# Altium schematic sheet Buck_converter.SchDoc
size A4; SheetNumber: 11; SheetTotal: 14
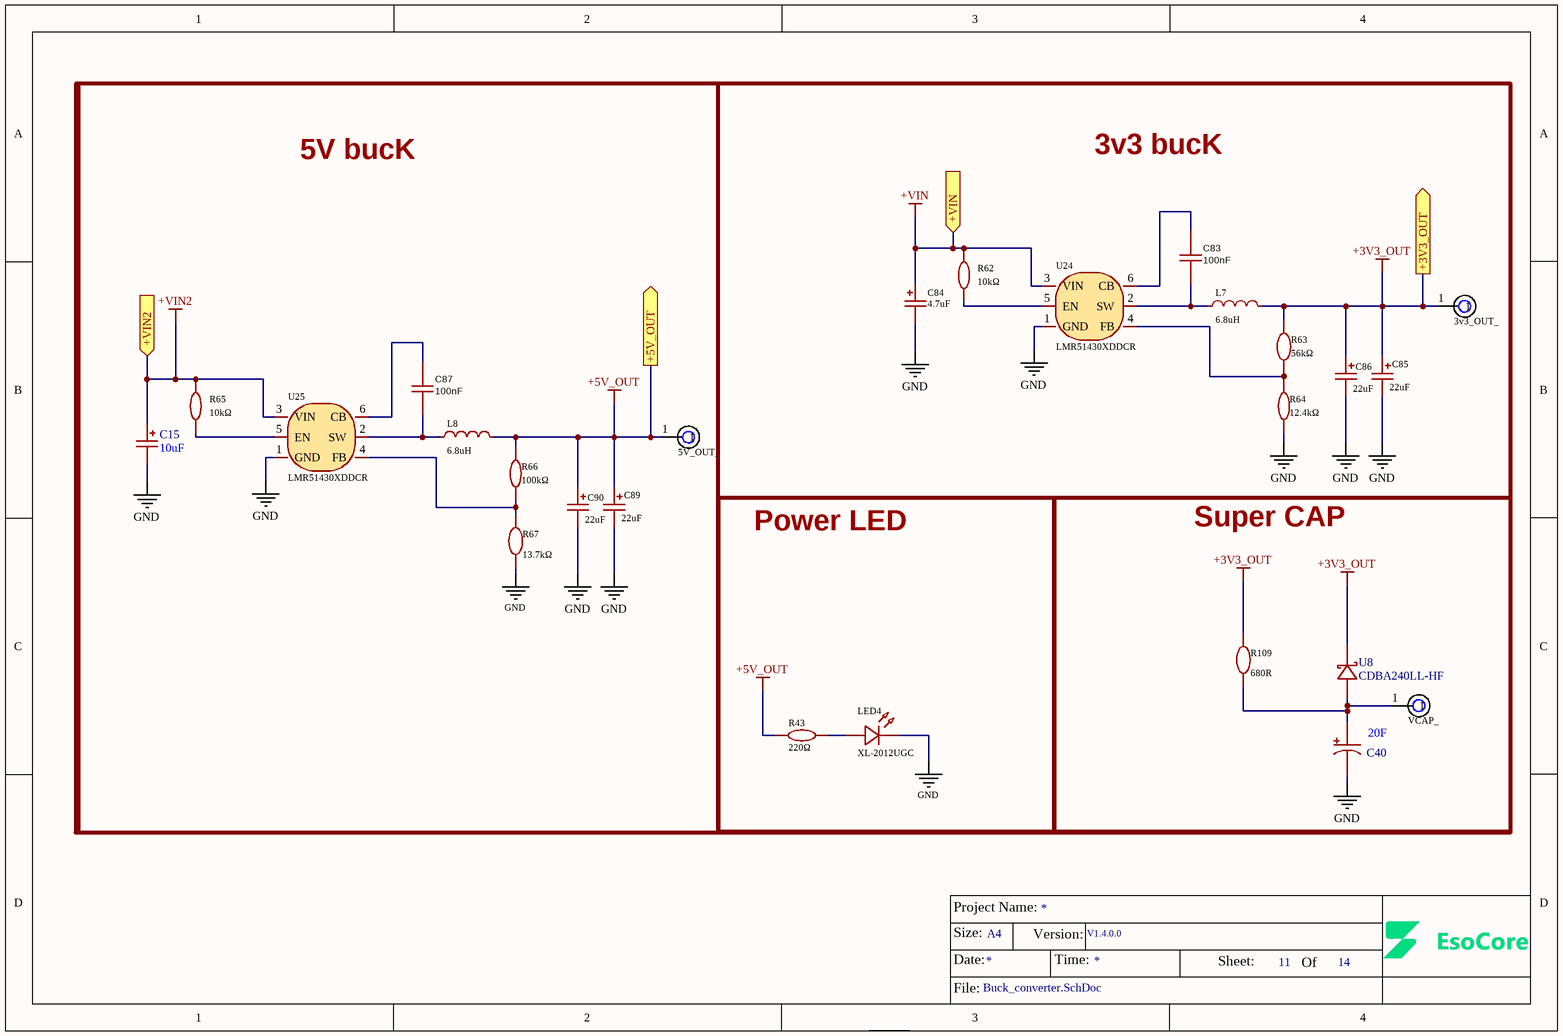
[diagram p0: Buck_converter.SchDoc]

## Parts
3v3_OUT_  TP  [TP]  (value not drawn)  (no BOM)
5V_OUT_  TP  [TP]  (value not drawn)  (no BOM)
C15  10uF  [CASE-C_6032]
C40  20F  [CAP-TH_BD8.0-P3.50-D0.6-FD]
C83  100nF  [C_0805]
C84  4.7uF  [CAP-SMD_L6.0-W3.2-R-RD]
C85  22uF  [CASE-A_3216]
C86  22uF  [CASE-A_3216]
C87  100nF  [C_0805]
C89  22uF  [CASE-A_3216]
C90  22uF  [CASE-A_3216]
L7  6.8uH  [IND-SMD_L5.4-W5.2_SLO0530H6R8MTT]
L8  6.8uH  [IND-SMD_L5.4-W5.2_SLO0530H6R8MTT]
LED4  XL-2012UGC  [LED0805-RD_GREEN]
R43  220Ω  [R_0603]
R62  10kΩ  [R_0603]
R63  56kΩ  [R_0805]
R64  12.4kΩ  [R_0805]
R65  10kΩ  [R_0603]
R66  100kΩ  [R_0805]
R67  13.7kΩ  [R_0805]
R109  680R  [R_0805]
U8  CDBA240LL-HF  [SMA_L4.4-W2.5-LS5.2-R-RD]
U24  LMR51430XDDCR  [SOT-23-6_L2.9-W1.6-P0.95-LS2.8-BR]
U25  LMR51430XDDCR  [SOT-23-6_L2.9-W1.6-P0.95-LS2.8-BR]
VCAP_  TP  [TP]  (value not drawn)  (no BOM)

## Blocks framed on the sheet
3v3 bucK: 3v3_OUT_ C83-C86 L7 R62-R64 U24
5V bucK: 5V_OUT_ C15 C87 C89 C90 L8 R65-R67 U25
Power LED: LED4 R43
Super CAP: C40 R109 U8 VCAP_

## Ports
+3V3_OUT (out), +5V_OUT (out), +VIN2 (in), +VIN (in)

## Nets
+3V3_OUT: 3v3_OUT_.1 C85.1 C86.1 L7.2 R63.2 R109.2 U8.2(K) ; port +3V3_OUT
+5V_OUT: 5V_OUT_.1 C89.1 C90.1 L8.2 R43.2 R66.2 ; port +5V_OUT
+VIN: C84.1 R62.2 U24.3(VIN) ; port +VIN
+VIN2: C15.1 R65.2 U25.3(VIN) ; port +VIN2
GND: C15.2 C40.2 C84.2 C85.2 C86.2 C89.2 C90.2 LED4.1(K) R64.1 R67.1 U24.1(GND) U25.1(GND)
NetC40_1: C40.1 R109.1 U8.1(A) VCAP_.1
NetC83_1: C83.1 L7.1 U24.2(SW)
NetC83_2: C83.2 U24.6(CB)
NetC87_1: C87.1 L8.1 U25.2(SW)
NetC87_2: C87.2 U25.6(CB)
NetLED4_2: LED4.2(A) R43.1
NetR62_1: R62.1 U24.5(EN)
NetR63_1: R63.1 R64.2 U24.4(FB)
NetR65_1: R65.1 U25.5(EN)
NetR66_1: R66.1 R67.2 U25.4(FB)

## Notes on the sheet
- Project Name:
- Size:
- Date:
- A4
- Version:
- Time:
- V1.4.0.0
- Sheet:
- Of
- File:

## Library data of the parts
C15 = TAJC106K035RNJ: Manufacturer: Kyocera AVX; Add into BOM: yes; Tolerance: ±10%; Voltage Rating: 35V; Equivalent Series Resistance(ESR): 1.6Ω@100kHz; Symbol: TAJC106K035RNJ; Device: TAJC106K035RNJ; LCSC Part Name: 10uF ±10% 35V; Supplier Part: C7211; Manufacturer Part: TAJC106K035RNJ; Supplier Footprint: CASE-C-6032-28(mm); JLCPCB Part Class: Extended Part; Supplier: LCSC; Convert to PCB: yes; Value: 10uF; Operating Temperature: -55℃~+125℃
C40 = SLA3R8L2060813: Manufacturer: Ymin(永铭); Add into BOM: yes; Tolerance: -10%~+30%; Voltage Rating: 3.8V; Equivalent Series Resistance(ESR): 500mΩ; Lifetime: 1000hrs@85℃; Symbol: SLA3R8L2060813; Device: SLA3R8L2060813; LCSC Part Name: 20F -10%~+30% 3.8V; Supplier Part: C970391; Manufacturer Part: SLA3R8L2060813; Supplier Footprint: 插件,P=3.5mm; JLCPCB Part Class: Extended Part; Datasheet: https://item.szlcsc.com/datasheet/SLA3R8L2060813/1059775.html; Supplier: LCSC; Convert to PCB: yes; Value: 20F; Current - Leakage: -; Operating Temperature: -40℃~+85℃; Diameter: 8mm; Height - Seated(Max): -
C83 C87 = 100nF: Manufacturer Part: CC0805KRX7R9BB104; Manufacturer: YAGEO(国巨); nameAlias: Value; Supplier: LCSC; Supplier Part: C49678; JLCPCB Part Class: Basic Part; spicePre: C; spiceSymbolName: CC0805KRX7R9BB104
C84 = TAJC475K035RNJ: Manufacturer: Kyocera AVX; Add into BOM: yes; Tolerance: ±10%; Voltage Rating: 35V; Equivalent Series Resistance(ESR): 2.2Ω@100kHz; Symbol: TAJC475K035RNJ; Device: TAJC475K035RNJ; LCSC Part Name: 4.7uF ±10% 35V; Supplier Part: C11378; Manufacturer Part: TAJC475K035RNJ; Supplier Footprint: CASE-C-6032-28(mm); JLCPCB Part Class: Extended Part; Supplier: LCSC; Convert to PCB: yes; Value: 4.7uF; Operating Temperature: -55℃~+125℃
C85 C86 C89 C90 = TAJA226K010RNJ: Manufacturer: Kyocera AVX; Add into BOM: yes; Tolerance: ±10%; Voltage Rating: 10V; Equivalent Series Resistance(ESR): 3Ω@100kHz; Symbol: TAJA226K010RNJ; Device: TAJA226K010RNJ; LCSC Part Name: 22uF ±10% 10V; Supplier Part: C11366; Manufacturer Part: TAJA226K010RNJ; Supplier Footprint: CASE-A-3216-18(mm); JLCPCB Part Class: Extended Part; Supplier: LCSC; Convert to PCB: yes; Value: 22uF; Operating Temperature: -55℃~+125℃
L7 L8 = SLO0530H6R8MTT: Manufacturer: Sunltech(顺磁); Add into BOM: yes; Tolerance: ±20%; Current Rating: 4A; DC Resistance(DCR): 66mΩ; Symbol: SLO0530H6R8MTT; Device: SLO0530H6R8MTT; LCSC Part Name: 6.8uH ±20%; Supplier Part: C325965; Manufacturer Part: SLO0530H6R8MTT; Supplier Footprint: SMD; JLCPCB Part Class: Extended Part; Datasheet: https://item.szlcsc.com/datasheet/SLO0530H6R8MTT/306182.html; Supplier: LCSC; Convert to PCB: yes; Value: 6.8uH
LED4 = XL-2012UGC: Manufacturer: XINGLIGHT(成兴光); Add into BOM: yes; Illumination Color: Emerald; Voltage - Forward(Vf): 3.2V; Power(Watts): 70mW; Forward Current: 20mA; Wavelength - Dominant: 515nm~535nm; Peak Wavelength: 525nm; Lens Color: Colorless Transparent Lens; Luminous Intensity: 750mcd; Viewing Angle: 120°; Mounting Sytle: Positive Stick; Symbol: XL-2012UGC; Device: XL-2012UGC; LCSC Part Name: XL-2012UGC; Supplier Part: C965815; Manufacturer Part: XL-2012UGC; Supplier Footprint: 0805; JLCPCB Part Class: Extended Part; Datasheet: https://item.szlcsc.com/datasheet/XL-2012UGC/1051424.html; Supplier: LCSC; Convert to PCB: yes; Color Temperature: -; Operating Temperature: -20℃~+85℃
R43 = RC0603FR-07220RL: Manufacturer: YAGEO(国巨); Add into BOM: yes; Tolerance: ±1%; Temperature Coefficient: ±100ppm/℃; Symbol: RC0603FR-07220RL; Device: RC0603FR-07220RL; LCSC Part Name: 厚膜电阻 220Ω ±1% 100mW; Supplier Part: C107696; Manufacturer Part: RC0603FR-07220RL; Supplier Footprint: 0603; JLCPCB Part Class: Extended Part; Datasheet: https://atta.szlcsc.com/upload/public/pdf/source/20180821/C275644_0D56F95EFF785E7D9A1FEF436B37DA78.pdf; Supplier: LCSC; Convert to PCB: yes; Type: Thick Film Resistors; Value: 220Ω; Operating Temperature Range: -55℃~+155℃
R62 R65 = RC0603FR-0710KL: Manufacturer: YAGEO(国巨); Add into BOM: yes; Tolerance: ±1%; Temperature Coefficient: ±100ppm/℃; Symbol: RC0603FR-0710KL; Device: RC0603FR-0710KL; LCSC Part Name: 厚膜电阻 10kΩ ±1% 100mW; Supplier Part: C98220; Manufacturer Part: RC0603FR-0710KL; Supplier Footprint: 0603; JLCPCB Part Class: Extended Part; Datasheet: https://atta.szlcsc.com/upload/public/pdf/source/20180927/C295883_E8D83085EA81BD7DE0B2B681138C15EE.pdf; Supplier: LCSC; Convert to PCB: yes; Type: Thick Film Resistors; Value: 10kΩ; Operating Temperature Range: -55℃~+155℃
R63 = RT0805BRC0756KL: Manufacturer: YAGEO(国巨); Add into BOM: yes; Tolerance: ±0.1%; Temperature Coefficient: ±15ppm/℃; Symbol: RT0805BRC0756KL; Device: RT0805BRC0756KL; LCSC Part Name: 薄膜电阻 56kΩ ±0.1% 125mW; Supplier Part: C706209; Manufacturer Part: RT0805BRC0756KL; Supplier Footprint: 0805; JLCPCB Part Class: Extended Part; Datasheet: https://atta.szlcsc.com/upload/public/pdf/source/20200720/C706209_4397051C8D9630730FE7B6DC464F826A.pdf; Supplier: LCSC; Convert to PCB: yes; Type: Thin Film Resistor; Value: 56kΩ; Operating Temperature Range: -55℃~+155℃
R64 = RC0805FR-0712K4L: Manufacturer: YAGEO(国巨); Add into BOM: yes; Tolerance: ±1%; Temperature Coefficient: ±100ppm/℃; Symbol: RC0805FR-0712K4L; Device: RC0805FR-0712K4L; LCSC Part Name: 厚膜电阻 12.4kΩ ±1% 125mW; Supplier Part: C137595; Manufacturer Part: RC0805FR-0712K4L; Supplier Footprint: 0805; JLCPCB Part Class: Extended Part; Datasheet: https://atta.szlcsc.com/upload/public/pdf/source/20180821/C275644_0D56F95EFF785E7D9A1FEF436B37DA78.pdf; Supplier: LCSC; Convert to PCB: yes; Type: Thick Film Resistors; Value: 12.4kΩ; Operating Temperature Range: -55℃~+155℃
R66 = RC0805FR-07100KL: Manufacturer: YAGEO(国巨); Add into BOM: yes; Tolerance: ±1%; Temperature Coefficient: ±100ppm/℃; Symbol: RC0805FR-07100KL; Device: RC0805FR-07100KL; LCSC Part Name: 厚膜电阻 100kΩ ±1% 125mW; Supplier Part: C96346; Manufacturer Part: RC0805FR-07100KL; Supplier Footprint: 0805; JLCPCB Part Class: Extended Part; Datasheet: https://atta.szlcsc.com/upload/public/pdf/source/20170708/1499509500945.pdf; Supplier: LCSC; Convert to PCB: yes; Type: Thick Film Resistors; Value: 100kΩ; Operating Temperature Range: -55℃~+155℃
R67 = RT0805BRD0713K7L: Manufacturer: YAGEO(国巨); Add into BOM: yes; Tolerance: ±0.1%; Power(Watts): 125mW; Voltage-Supply(Max): 150V; Temperature Coefficient: ±25ppm/℃; Symbol: RT0805BRD0713K7L; Device: RT0805BRD0713K7L; LCSC Part Name: 薄膜电阻 13.7kΩ ±0.1% 125mW; Supplier Part: C865183; Manufacturer Part: RT0805BRD0713K7L; Supplier Footprint: 0805; JLCPCB Part Class: Extended Part; Datasheet: https://atta.szlcsc.com/upload/public/pdf/source/20250609/0E6D5617EADA80FA3B707391883DF2D5.pdf; Supplier: LCSC; Convert to PCB: yes; Type: Thin Film Resistor; Value: 13.7kΩ; Operating Temperature: -55℃~+155℃
R109 = RT0805BRD0713K7L: Manufacturer: YAGEO(国巨); Add into BOM: yes; Value: 13.7kΩ; Tolerance: ±0.1%; Power(Watts): 125mW; Voltage-Supply(Max): 150V; Temperature Coefficient: ±25ppm/℃; Symbol: RT0805BRD0713K7L; Device: RT0805BRD0713K7L; LCSC Part Name: 薄膜电阻 13.7kΩ ±0.1% 125mW; Supplier Part: C865183; Manufacturer Part: RT0805BRD0713K7L; Supplier Footprint: 0805; JLCPCB Part Class: Extended Part; Datasheet: https://atta.szlcsc.com/upload/public/pdf/source/20250609/0E6D5617EADA80FA3B707391883DF2D5.pdf; Supplier: LCSC; Convert to PCB: yes; Type: Thin Film Resistor; Operating Temperature: -55℃~+155℃
U8 = CDBA240LL-HF: Manufacturer: Comchip(典琦); Add into BOM: yes; Voltage - Forward(Vf@If): 310mV@2A; Voltage - DC Reverse(Vr): 40V; Current - Rectified: 2A; Reverse Leakage Current (Ir): 200uA@40V; Operating Junction Temperature Range: -55℃~+100℃; Non-Repetitive Peak Forward Surge Current: 70A; Symbol: CDBA240LL-HF; Device: CDBA240LL-HF; LCSC Part Name: 电压:40V 电流:2A; Supplier Part: C2886093; Manufacturer Part: CDBA240LL-HF; Supplier Footprint: SMA(DO-214AC); JLCPCB Part Class: Extended Part; Datasheet: https://item.szlcsc.com/datasheet/CDBA240LL-HF/3097132.html; Supplier: LCSC; Convert to PCB: yes
U24 U25 = LMR51430XDDCR: Manufacturer: TI(德州仪器); Add into BOM: yes; Function: Buck; Voltage - Supply: 4.5V~36V; Output Voltage: 600mV~34.2V; Output Current: 3A; Frequency - Switching: 500kHz; Number of Outputs: 1; Switch tube (built-in/external): Built-In; Output Type: Adjustable; Symbol: LMR51430XDDCR; Device: LMR51430XDDCR; LCSC Part Name: LMR51430XDDCR; Supplier Part: C5185863; Manufacturer Part: LMR51430XDDCR; Supplier Footprint: SOT-23-6; JLCPCB Part Class: Extended Part; Datasheet: https://item.szlcsc.com/datasheet/LMR51430XDDCR/5856347.html; Supplier: LCSC; Convert to PCB: yes; Operating Temperature: -40℃~+150℃@(TJ); Synchronous Rectifier: Yes; Topology: Buck; Quiescent Current: -